# Altium schematic sheet Drivers.SchDoc
size B
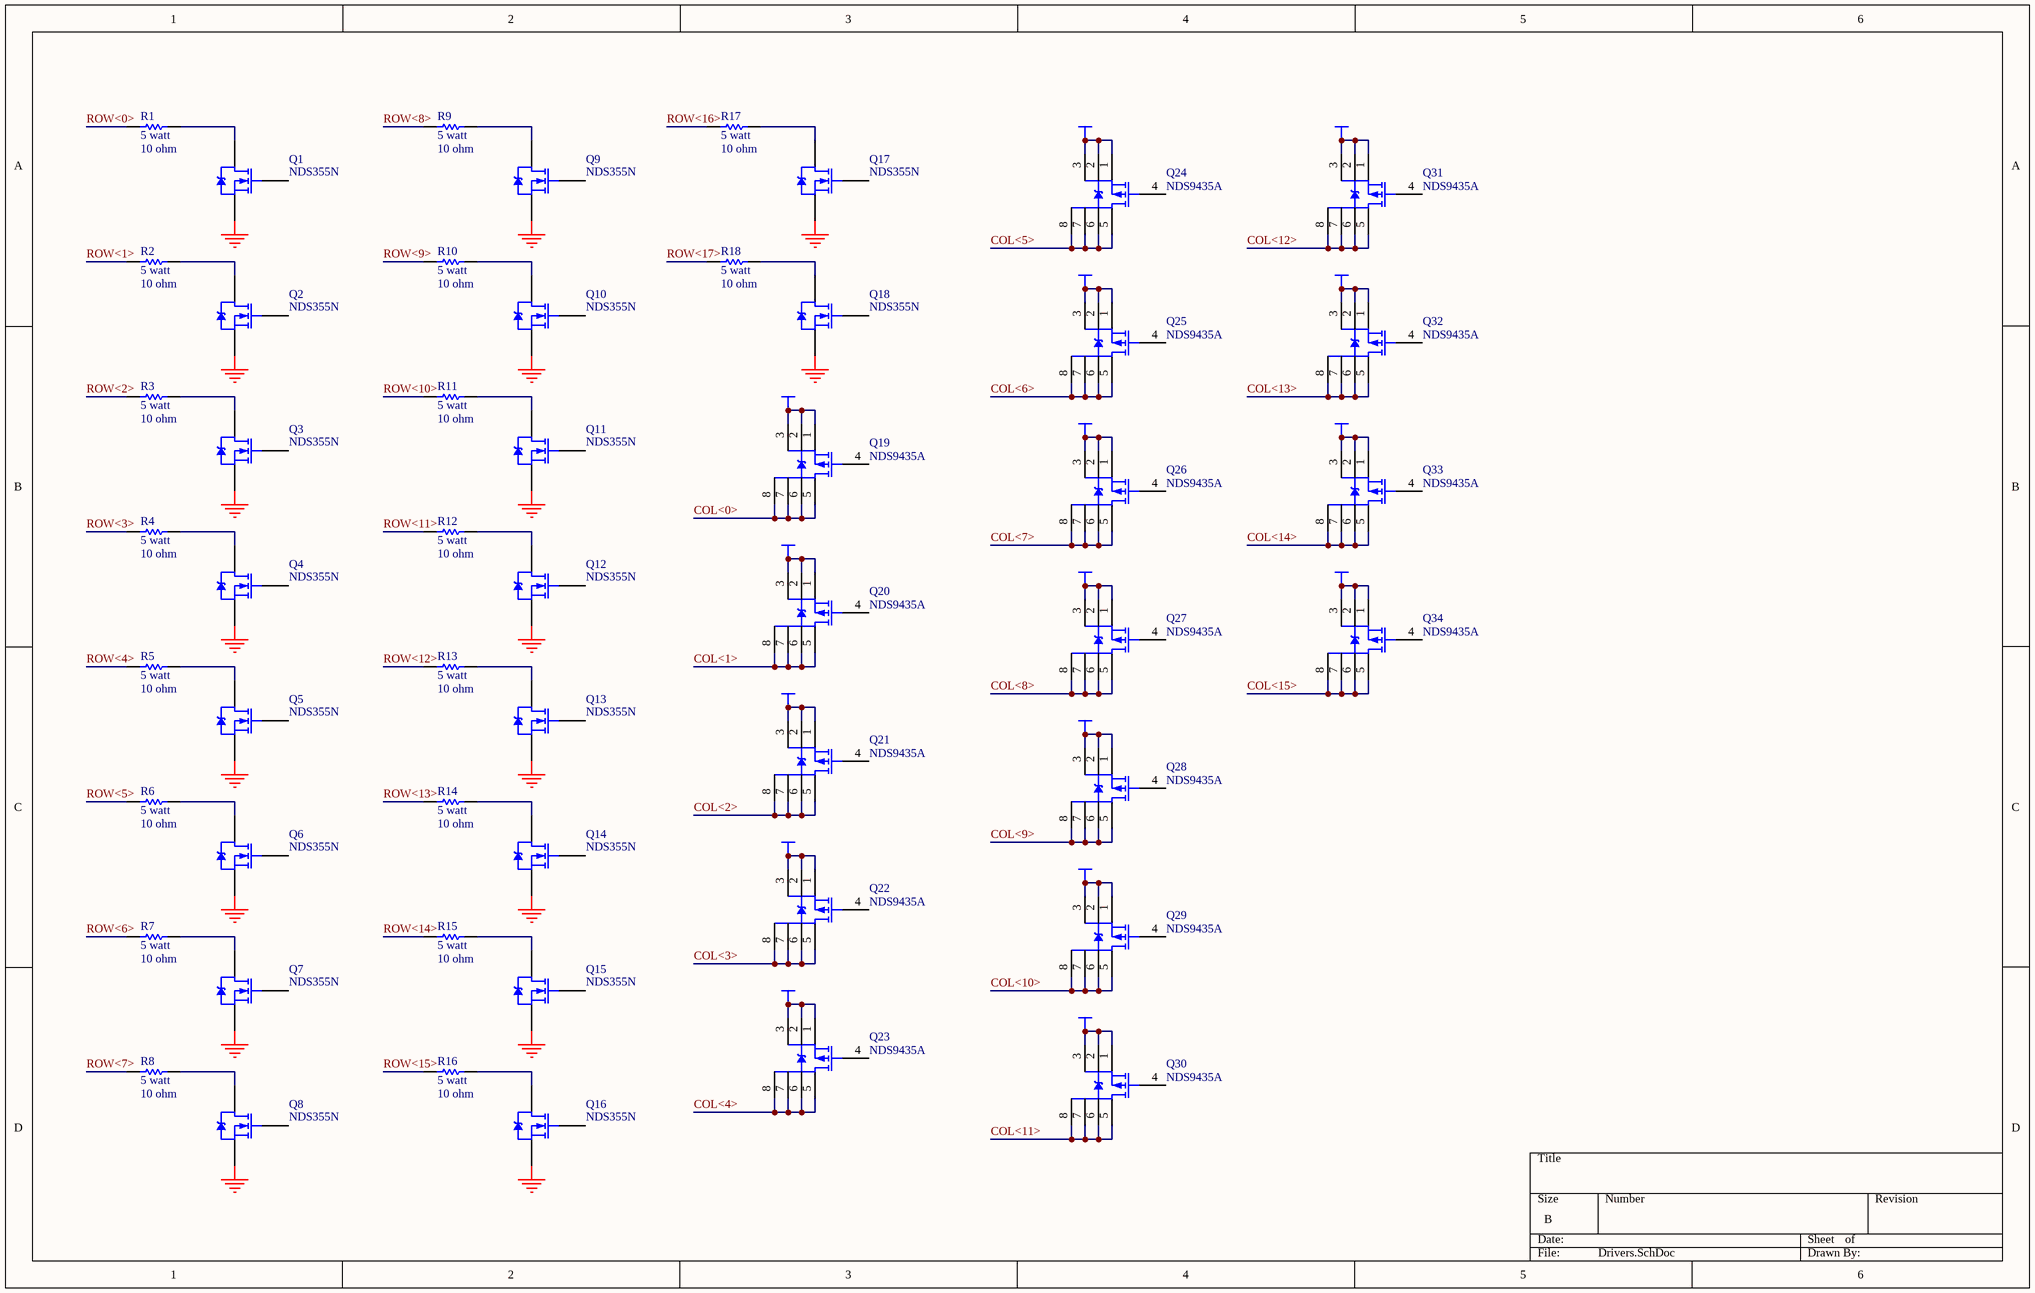
[diagram p0: Drivers.SchDoc]

## Parts
Q1  NDS355N  [SO-G3]
Q2  NDS355N  [SO-G3]
Q3  NDS355N  [SO-G3]
Q4  NDS355N  [SO-G3]
Q5  NDS355N  [SO-G3]
Q6  NDS355N  [SO-G3]
Q7  NDS355N  [SO-G3]
Q8  NDS355N  [SO-G3]
Q9  NDS355N  [SO-G3]
Q10  NDS355N  [SO-G3]
Q11  NDS355N  [SO-G3]
Q12  NDS355N  [SO-G3]
Q13  NDS355N  [SO-G3]
Q14  NDS355N  [SO-G3]
Q15  NDS355N  [SO-G3]
Q16  NDS355N  [SO-G3]
Q17  NDS355N  [SO-G3]
Q18  NDS355N  [SO-G3]
Q19  NDS9435A  [SO-G8]
Q20  NDS9435A  [SO-G8]
Q21  NDS9435A  [SO-G8]
Q22  NDS9435A  [SO-G8]
Q23  NDS9435A  [SO-G8]
Q24  NDS9435A  [SO-G8]
Q25  NDS9435A  [SO-G8]
Q26  NDS9435A  [SO-G8]
Q27  NDS9435A  [SO-G8]
Q28  NDS9435A  [SO-G8]
Q29  NDS9435A  [SO-G8]
Q30  NDS9435A  [SO-G8]
Q31  NDS9435A  [SO-G8]
Q32  NDS9435A  [SO-G8]
Q33  NDS9435A  [SO-G8]
Q34  NDS9435A  [SO-G8]
R1  5 watt  value 10 ohm  [AXIAL-1.0]
R2  5 watt  value 10 ohm  [AXIAL-1.0]
R3  5 watt  value 10 ohm  [AXIAL-1.0]
R4  5 watt  value 10 ohm  [AXIAL-1.0]
R5  5 watt  value 10 ohm  [AXIAL-1.0]
R6  5 watt  value 10 ohm  [AXIAL-1.0]
R7  5 watt  value 10 ohm  [AXIAL-1.0]
R8  5 watt  value 10 ohm  [AXIAL-1.0]
R9  5 watt  value 10 ohm  [AXIAL-1.0]
R10  5 watt  value 10 ohm  [AXIAL-1.0]
R11  5 watt  value 10 ohm  [AXIAL-1.0]
R12  5 watt  value 10 ohm  [AXIAL-1.0]
R13  5 watt  value 10 ohm  [AXIAL-1.0]
R14  5 watt  value 10 ohm  [AXIAL-1.0]
R15  5 watt  value 10 ohm  [AXIAL-1.0]
R16  5 watt  value 10 ohm  [AXIAL-1.0]
R17  5 watt  value 10 ohm  [AXIAL-1.0]
R18  5 watt  value 10 ohm  [AXIAL-1.0]

## Nets
+5: Q19.1(S) Q19.2(S) Q19.3(S) Q20.1(S) Q20.2(S) Q20.3(S) Q21.1(S) Q21.2(S) Q21.3(S) Q22.1(S) Q22.2(S) Q22.3(S) Q23.1(S) Q23.2(S) Q23.3(S) Q24.1(S) Q24.2(S) Q24.3(S) Q25.1(S) Q25.2(S) Q25.3(S) Q26.1(S) Q26.2(S) Q26.3(S) Q27.1(S) Q27.2(S) Q27.3(S) Q28.1(S) Q28.2(S) Q28.3(S) Q29.1(S) Q29.2(S) Q29.3(S) Q30.1(S) Q30.2(S) Q30.3(S) Q31.1(S) Q31.2(S) Q31.3(S) Q32.1(S) Q32.2(S) Q32.3(S) Q33.1(S) Q33.2(S) Q33.3(S) Q34.1(S) Q34.2(S) Q34.3(S)
GND: Q1.2(S) Q2.2(S) Q3.2(S) Q4.2(S) Q5.2(S) Q6.2(S) Q7.2(S) Q8.2(S) Q9.2(S) Q10.2(S) Q11.2(S) Q12.2(S) Q13.2(S) Q14.2(S) Q15.2(S) Q16.2(S) Q17.2(S) Q18.2(S)
COL<0>: Q19.5(D) Q19.6(D) Q19.7(D) Q19.8(D)
COL<1>: Q20.5(D) Q20.6(D) Q20.7(D) Q20.8(D)
COL<2>: Q21.5(D) Q21.6(D) Q21.7(D) Q21.8(D)
COL<3>: Q22.5(D) Q22.6(D) Q22.7(D) Q22.8(D)
COL<4>: Q23.5(D) Q23.6(D) Q23.7(D) Q23.8(D)
COL<5>: Q24.5(D) Q24.6(D) Q24.7(D) Q24.8(D)
COL<6>: Q25.5(D) Q25.6(D) Q25.7(D) Q25.8(D)
COL<7>: Q26.5(D) Q26.6(D) Q26.7(D) Q26.8(D)
COL<8>: Q27.5(D) Q27.6(D) Q27.7(D) Q27.8(D)
COL<9>: Q28.5(D) Q28.6(D) Q28.7(D) Q28.8(D)
COL<10>: Q29.5(D) Q29.6(D) Q29.7(D) Q29.8(D)
COL<11>: Q30.5(D) Q30.6(D) Q30.7(D) Q30.8(D)
COL<12>: Q31.5(D) Q31.6(D) Q31.7(D) Q31.8(D)
COL<13>: Q32.5(D) Q32.6(D) Q32.7(D) Q32.8(D)
COL<14>: Q33.5(D) Q33.6(D) Q33.7(D) Q33.8(D)
COL<15>: Q34.5(D) Q34.6(D) Q34.7(D) Q34.8(D)
ROW<0>: R1.1
ROW<1>: R2.1
ROW<2>: R3.1
ROW<3>: R4.1
ROW<4>: R5.1
ROW<5>: R6.1
ROW<6>: R7.1
ROW<7>: R8.1
ROW<8>: R9.1
ROW<9>: R10.1
ROW<10>: R11.1
ROW<11>: R12.1
ROW<12>: R13.1
ROW<13>: R14.1
ROW<14>: R15.1
ROW<15>: R16.1
ROW<16>: R17.1
ROW<17>: R18.1
NetQ1_3: Q1.3(D) R1.2
NetQ2_3: Q2.3(D) R2.2
NetQ3_3: Q3.3(D) R3.2
NetQ4_3: Q4.3(D) R4.2
NetQ5_3: Q5.3(D) R5.2
NetQ6_3: Q6.3(D) R6.2
NetQ7_3: Q7.3(D) R7.2
NetQ8_3: Q8.3(D) R8.2
NetQ9_3: Q9.3(D) R9.2
NetQ10_3: Q10.3(D) R10.2
NetQ11_3: Q11.3(D) R11.2
NetQ12_3: Q12.3(D) R12.2
NetQ13_3: Q13.3(D) R13.2
NetQ14_3: Q14.3(D) R14.2
NetQ15_3: Q15.3(D) R15.2
NetQ16_3: Q16.3(D) R16.2
NetQ17_3: Q17.3(D) R17.2
NetQ18_3: Q18.3(D) R18.2

Not connected (* = marked no-connect by the designer): Q1 1(G); Q2 1(G); Q3 1(G); Q4 1(G); Q5 1(G); Q6 1(G); Q7 1(G); Q8 1(G); Q9 1(G); Q10 1(G); Q11 1(G); Q12 1(G); Q13 1(G); Q14 1(G); Q15 1(G); Q16 1(G); Q17 1(G); Q18 1(G); Q19 4(G); Q20 4(G); Q21 4(G); Q22 4(G); Q23 4(G); Q24 4(G); Q25 4(G); Q26 4(G); Q27 4(G); Q28 4(G); Q29 4(G); Q30 4(G); Q31 4(G); Q32 4(G); Q33 4(G); Q34 4(G)

## Library data of the parts
Q1-Q18 = NDS355N: N-Channel Logic Level Enhancement Mode FET; Manufacturer: Fairchild; Class I: Discrete; Class II: MOSFET - Power; Package Reference: SOT23
Q19-Q34 = NDS9435A: 30V P-Channel PowerTrench MOSFET; Manufacturer: Fairchild; Class I: Discrete; Class II: MOSFET - Power; Package Reference: SO-8
R1-R18 = Res1: Resistor; Manufacturer: Generic Components; Class I: Passive; Class II: Resistor; Published: 8-Jun-2000; Revision: July-2002: Re-released for DXP Platform.; Publisher: Altium Limited